# EAGLE design 1sqInchLogicAnalyzer (EAGLE 6.4)
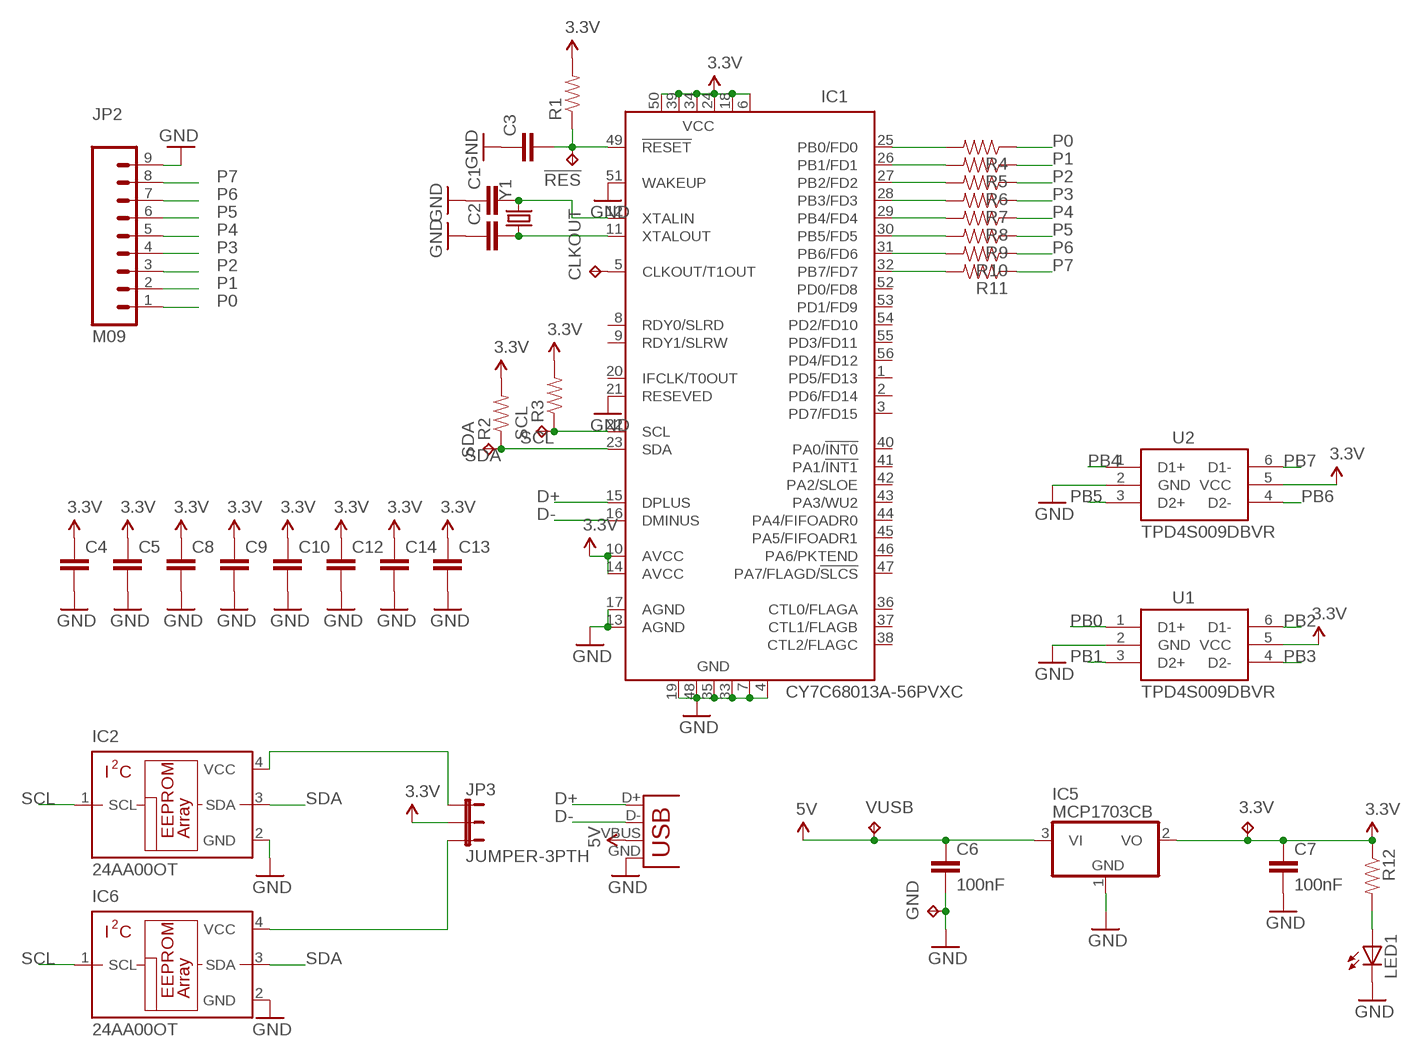
[diagram p0: schematic, sheet 1]

## Parts
3.3V  TPTP07R  [TP07R]
!RES  TPTP07R  [TP07R]
C1  CAP0402-CAP  [0402-CAP]
C2  CAP0402-CAP  [0402-CAP]
C3  CAP0402-CAP  [0402-CAP]
C4  CAP0402-CAP  [0402-CAP]
C5  CAP0402-CAP  [0402-CAP]
C6  100nF  CAP0603-CAP  [0603-CAP]
C7  100nF  CAP0603-CAP  [0603-CAP]
C8  CAP0402-CAP  [0402-CAP]
C9  CAP0402-CAP  [0402-CAP]
C10  CAP0402-CAP  [0402-CAP]
C12  CAP0402-CAP  [0402-CAP]
C13  CAP0402-CAP  [0402-CAP]
C14  CAP0402-CAP  [0402-CAP]
CLKOUT  TPTP07R  [TP07R]
GND  TPTP07R  [TP07R]
IC1  CY7C68013A-56PVXC  [SSOP56]
IC2  24AA00OT  [SOT23-5L]
IC5  MCP1703CB  [SOT23]
IC6  24AA00OT  [SOT23-5L]
JP2  M09  [1X09]
JP3  JUMPER-3PTH  [1X03]
LED1  LED0603  [LED-0603]
R1  RESISTOR0402-RES  [0402-RES]
R2  RESISTOR0402-RES  [0402-RES]
R3  RESISTOR0402-RES  [0402-RES]
R4  RESISTOR0402-RES  [0402-RES]
R5  RESISTOR0402-RES  [0402-RES]
R6  RESISTOR0402-RES  [0402-RES]
R7  RESISTOR0402-RES  [0402-RES]
R8  RESISTOR0402-RES  [0402-RES]
R9  RESISTOR0402-RES  [0402-RES]
R10  RESISTOR0402-RES  [0402-RES]
R11  RESISTOR0402-RES  [0402-RES]
R12  RESISTOR0402-RES  [0402-RES]
SCL  TPTP07R  [TP07R]
SDA  TPTP07R  [TP07R]
U1  TPD4S009DBVR  [TPD4S009DBVR]
U2  TPD4S009DBVR  [TPD4S009DBVR]
VUSB  TPTP07R  [TP07R]
X2  USB-MICROB  [USB-MICROB]
Y1  CRYSTAL5X3  [CRYSTAL-SMD-5X3]

## Nets
3.3V: 3.3V.TP C4.1 C5.1 C7.1 C8.1 C9.1 C10.1 C12.1 C13.1 C14.1 IC1.6(VCC) IC1.10(AVCC) IC1.14(AVCC) IC1.18(VCC) IC1.24(VCC) IC1.34(VCC) IC1.39(VCC) IC1.50(VCC) IC5.2(VO) JP3.2 R1.2 R2.2 R3.2 R12.1 U1.5(VCC) U2.5(VCC)
5V: C6.1 IC5.3(VI) VUSB.TP X2.VBUS
D+: IC1.15(DPLUS) X2.D+
D-: IC1.16(DMINUS) X2.D-
GND: C1.1 C2.1 C3.1 C4.2 C5.2 C6.2 C7.2 C8.2 C9.2 C10.2 C12.2 C13.2 C14.2 GND.TP IC1.4(GND) IC1.7(GND) IC1.13(AGND) IC1.17(AGND) IC1.19(GND) IC1.21(RESEVED) IC1.33(GND) IC1.35(GND) IC1.48(GND) IC1.51(WAKEUP) IC2.2(GND) IC5.1(GND) IC6.2(GND) JP2.9 LED1.C U1.2(GND) U2.2(GND) X2.GND
N$1: IC6.4(VCC) JP3.3
N$2: IC2.4(VCC) JP3.1
N$3: C1.2 IC1.12(XTALIN) Y1.3
N$4: C2.2 IC1.11(XTALOUT) Y1.1
N$5: !RES.TP C3.2 IC1.49(!RESET) R1.1
N$6: LED1.A R12.2
N$7: CLKOUT.TP IC1.5(CLKOUT/T1OUT)
P0: JP2.1 R4.1
P1: JP2.2 R5.1
P2: JP2.3 R6.1
P3: JP2.4 R7.1
P4: JP2.5 R8.1
P5: JP2.6 R9.1
P6: JP2.7 R10.1
P7: JP2.8 R11.1
PB0: IC1.25(PB0/FD0) R4.2 U1.1(D1+)
PB1: IC1.26(PB1/FD1) R5.2 U1.3(D2+)
PB2: IC1.27(PB2/FD2) R6.2 U1.6(D1-)
PB3: IC1.28(PB3/FD3) R7.2 U1.4(D2-)
PB4: IC1.29(PB4/FD4) R8.2 U2.1(D1+)
PB5: IC1.30(PB5/FD5) R9.2 U2.3(D2+)
PB6: IC1.31(PB6/FD6) R10.2 U2.4(D2-)
PB7: IC1.32(PB7/FD7) R11.2 U2.6(D1-)
SCL: IC1.22(SCL) IC2.1(SCL) IC6.1(SCL) R3.1 SCL.TP
SDA: IC1.23(SDA) IC2.3(SDA) IC6.3(SDA) R2.1 SDA.TP
Unconnected: IC1.1(PD5/FD13) IC1.2(PD6/FD14) IC1.3(PD7/FD15) IC1.8(RDY0/SLRD) IC1.9(RDY1/SLRW) IC1.20(IFCLK/T0OUT) IC1.36(CTL0/FLAGA) IC1.37(CTL1/FLAGB) IC1.38(CTL2/FLAGC) IC1.40(PA0/!INT0) IC1.41(PA1/!INT1) IC1.42(PA2/SLOE) IC1.43(PA3/WU2) IC1.44(PA4/FIFOADR0) IC1.45(PA5/FIFOADR1) IC1.46(PA6/PKTEND) IC1.47(PA7/FLAGD/!SLCS) IC1.52(PD0/FD8) IC1.53(PD1/FD9) IC1.54(PD2/FD10) IC1.55(PD3/FD11) IC1.56(PD4/FD12)

## Library data of the parts
3.3V !RES CLKOUT GND SCL SDA VUSB = testpad:TP: Test pad
C1-C10 C12-C14 = SparkFun-Passives:CAP: Capacitor Standard 0603 ceramic capacitor, and 0.1" leaded capacitor.
IC1 = cypress:CY7C6801*A-56: EZ-USB FX2LP (TM) USB Microcontroller Source: http://www.cypress.com .. cy7c68013a_5.pdf; MF: CYPRESS SEMICONDUCTOR CORPORAT; MPN: CY7C68013A-56PVXC; OC_FARNELL: 1269134; OC_NEWARK: 19M7114
IC2 IC6 = microchip:24*00: Serial EEPROM 128 bit, I2C (AA = 1.8 V/LC = 2.5 V/C = 5.0 V); MF: MICROCHIP; MPN: 24AA00T-I/OTG; OC_FARNELL: 1331264; OC_NEWARK: 89H3038
IC5 = linear:MCP1703: 250 mA, 16V, Low Quiescent Current LDO Regulator Source: http://ww1.microchip.com/downloads/en/DeviceDoc/22049b.pdf
JP2 = SparkFun-Connectors:M09: Header 9 Standard 9-pin 0.1" header. Use with straight break away headers (SKU : PRT-00116), right angle break away headers (PRT-00553), swiss pins (PRT-00743), machine pins (PRT-00117), and female headers (PRT-00115).
JP3 = SparkFun-Passives:JUMPER-3
LED1 = SparkFun-LED:LED: LEDs Standard schematic elements and footprints for 5mm, 3mm, 1206, and 0603 sized LEDs. 5mm - Spark Fun Electronics SKU : COM-00529 (and others)
R1-R12 = SparkFun-Passives:RESISTOR: Resistor Basic schematic elements and footprints for 0603, 1206, and PTH resistors.
U1 U2 = esd-clamp:TPD4S009DBVR
X2 = SparkFun-Connectors:USB: USB Connectors USB-B-PTH is fully proven SKU : PRT-00139 USB-miniB is fully proven SKU : PRT-00587 USB-A-PCB is untested. USB-A-H is throughly reviewed, but untested. Spark Fun Electronics SKU : PRT-00437 USB-B-SMT is throughly reviewed, but untested. Needs silkscreen touching up. USB-A-S has not been used/tested USB-MB-H has not been used/tested
Y1 = SparkFun-FreqCtrl:CRYSTAL: Various standard crystals. Proven footprints. Spark Fun Electronics SKU : COM-00534

## Board
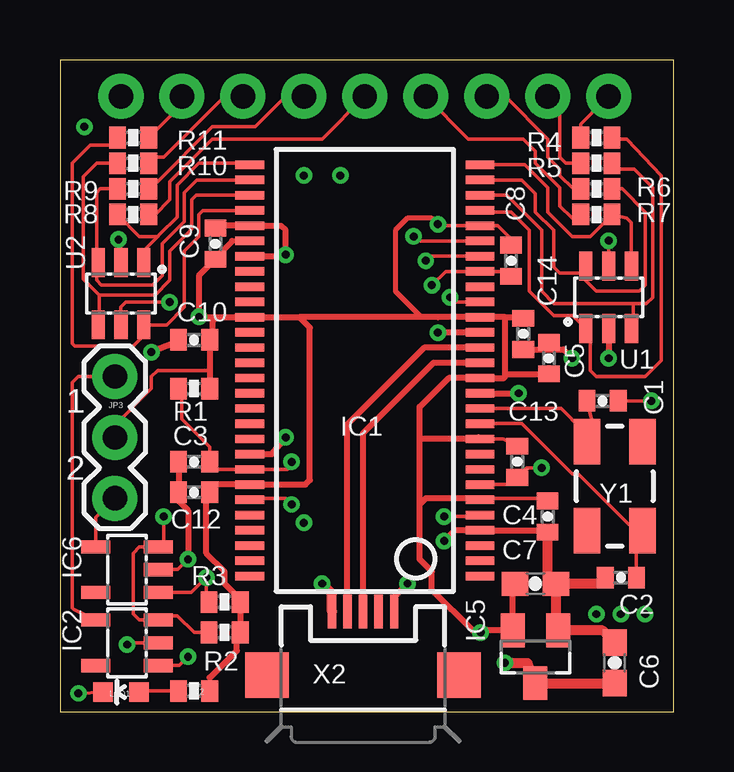
[diagram p1: board, top side]
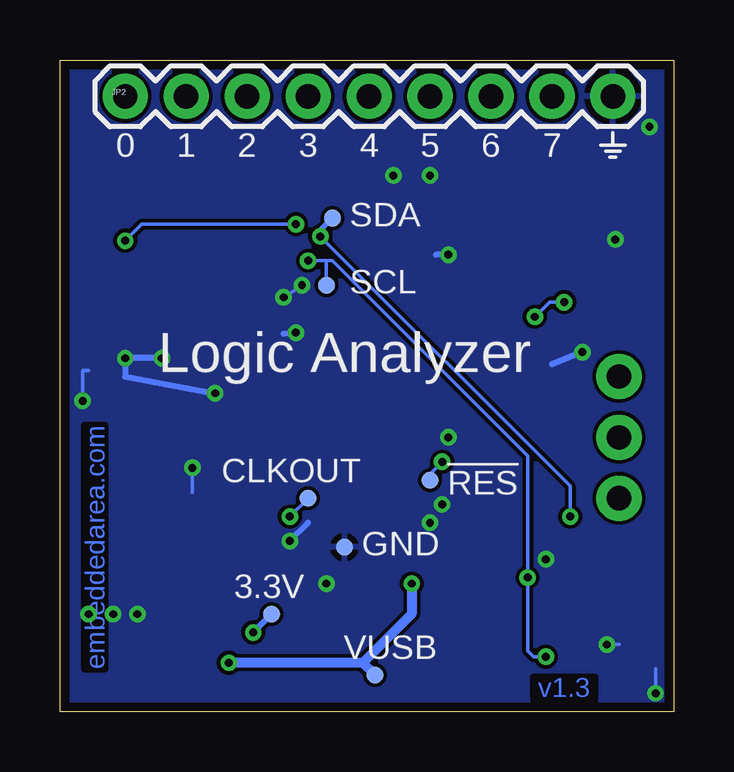
[diagram p2: board, bottom side, seen from below]

Size 25.58 x 27.17 mm. Coordinates in mm from the lower left corner, seen from the top.
Outline: 0,0 25.58,0 25.58,27.17 0,27.17 0,0
Copper layers (1*16): Top 0.0356mm / dielectric 1.5011mm / Bottom 0.0356mm
Design rules "LaenPCBOrder": minimum track width 6mil, minimum drill 13mil, track to track 6mil, track to pad 6mil, pad to pad 6mil, via to via 6mil, smd to smd 6mil, copper to edge 15mil, drill to drill 6mil, minimum pad ring 7mil, minimum via ring 7mil, stop-mask expansion 4mil, vias tented up to drill 13mil, thermal gap 10mil

### Footprints (pad centres in the part's own frame; a part is rotated, then mirrored left to right if it is on the bottom)
TP07R = smd 0.7 x 0.7: TP 0,0
0402-CAP = smd 0.7 x 0.9: 1 -0.65,0; 2 0.65,0
0603-CAP = smd 1.1 x 1: 1 -0.85,0; 2 0.85,0
SSOP56 = smd 0.35 x 1.2: 1 -8.572,-4.8; 2 -7.938,-4.8; 3 -7.303,-4.8; 4 -6.668,-4.8; 5 -6.032,-4.8; 6 -5.397,-4.8; 7 -4.763,-4.8; 8 -4.128,-4.8; 9 -3.493,-4.8; 10 -2.857,-4.8; 11 -2.223,-4.8; 12 -1.587,-4.8; 13 -0.953,-4.8; 14 -0.318,-4.8; 15 0.318,-4.8; 16 0.953,-4.8; 17 1.587,-4.8; 18 2.223,-4.8; 19 2.857,-4.8; 20 3.493,-4.8; 21 4.128,-4.8; 22 4.763,-4.8; 23 5.397,-4.8; 24 6.032,-4.8; 25 6.668,-4.8; 26 7.303,-4.8; 27 7.938,-4.8; 28 8.572,-4.8; 29 8.572,4.8; 30 7.938,4.8; 31 7.303,4.8; 32 6.668,4.8; 33 6.032,4.8; 34 5.397,4.8; 35 4.763,4.8; 36 4.128,4.8; 37 3.493,4.8; 38 2.857,4.8; 39 2.223,4.8; 40 1.587,4.8; 41 0.953,4.8; 42 0.318,4.8; 43 -0.318,4.8; 44 -0.953,4.8; 45 -1.587,4.8; 46 -2.223,4.8; 47 -2.857,4.8; 48 -3.493,4.8; 49 -4.128,4.8; 50 -4.763,4.8; 51 -5.397,4.8; 52 -6.032,4.8; 53 -6.668,4.8; 54 -7.303,4.8; 55 -7.938,4.8; 56 -8.572,4.8
SOT23-5L = smd 0.55 x 1.2: 1 -0.95,-1.3; 2 0,-1.3; 3 0.95,-1.3; 4 0.95,1.3; 5 -0.95,1.3
SOT23 = smd 1 x 1.4: 1 -0.95,-1.1; 2 0.95,-1.1; 3 0,1.1
1X09 = drill 1.016 pad 1.88: 1 0,0; 2 2.54,0; 3 5.08,0; 4 7.62,0; 5 10.16,0; 6 12.7,0; 7 15.24,0; 8 17.78,0; 9 20.32,0
1X03 = drill 1.016 pad 1.88: 1 0,0; 2 2.54,0; 3 5.08,0
LED-0603 = smd 0.8 x 0.8: A 0,-0.75; C 0,0.75
0402-RES = smd 0.7 x 0.9: 1 -0.65,0; 2 0.65,0
TPD4S009DBVR = smd 0.55 x 1.2: 1 -0.95,-1.3; 2 0,-1.3; 3 0.95,-1.3; 4 0.95,1.3; 5 0,1.3; 6 -0.95,1.3
USB-MICROB = smd 0.35 x 1.4: D+ 0,2.65; D- -0.65,2.65; GND 1.3,2.65; ID 0.65,2.65; VBUS -1.3,2.65 | smd 1.8 x 1.9: MT1 -4,0; MT2 4,0
CRYSTAL-SMD-5X3 = smd 1.9 x 1.1: 1 -1.85,-1.15; 2 1.85,-1.15; 3 1.85,1.15; 4 -1.85,1.15

### Placement (x,y rotation side)
3.3V  16.76,4.06 0 bottom
!RES  10.16,9.65 90 bottom
C1  22.61,12.95 180 top
C2  23.37,5.59 0 top
C3  5.59,10.41 0 top
C4  20.32,8.13 270 top
C5  19.3,15.75 270 top
C6  23.11,2.03 90 top
C7  19.81,5.33 0 top
C8  18.8,18.8 270 top
C9  6.48,19.51 90 top
C10  5.59,15.49 180 top
C12  5.59,9.14 180 top
C13  19.05,10.41 270 top
C14  20.37,14.73 90 top
CLKOUT  15.24,8.89 90 bottom
GND  13.72,6.86 0 bottom
IC1  12.7,14.22 90 top
IC2  2.79,2.87 90 top
IC5  19.81,2.29 180 top
IC6  2.79,5.92 90 top
JP2  22.86,25.65 0 bottom
JP3  2.29,13.97 270 top
LED1  2.54,0.81 90 top
R1  5.59,13.46 0 top
R2  6.86,3.3 0 top
R3  6.86,4.57 0 top
R4  22.35,23.93 0 top
R5  22.35,22.86 0 top
R6  22.35,21.79 0 top
R7  22.35,20.73 0 top
R8  3.05,20.73 180 top
R9  3.05,21.79 180 top
R10  3.05,22.86 180 top
R11  3.05,23.93 180 top
R12  5.59,0.86 180 top
SCL  14.48,17.78 270 bottom
SDA  14.22,20.57 90 bottom
U1  22.86,17.27 0 top
U2  2.54,17.42 180 top
VUSB  12.45,1.52 0 bottom
X2  12.63,1.52 0 top
Y1  23.11,9.4 90 top

### Tracks (layer width: path | path; a pad name or v marks a point on that pad's centre or on a via)
3.3V  (via drill 0.33)
  Top 0.152: IC1.10 18.46,11.37 C13.1 | R1.2 6.35,13.35 | IC1.39 7.32,16.45 | 7.32,16.45 6.54,16.45 | 6.35,15.61 C10.1 | R12.1 6.24,1.41 | 7.37,3.16 R2.2 | U2.5 2.54,16.87 2.74,17.07 v4.57,17.07 | 7.3,16.46 7.32,16.45 | IC1.24 18.24,20.26 18.8,19.7 C8.1 | 17.44,20.32 IC1.24 | IC1.6 17.56,8.89 20.32,8.89 20.46,9 C4.1 | U1.5 v22.86,19.63 | v15.75,20.32 15.81,20.26 IC1.24 | JP3.2 2.29,11.94 3.81,13.46 3.81,13.97 4.06,14.22 6.24,14.22
  Top 0.203: 7.43,19.62 7.18,19.62 | 6.48,18.92 C9.1 | v15.75,20.32 15.49,20.57 14.48,20.57 13.97,20.07 13.97,17.53 15.05,16.45 15.75,16.45
  Top 0.254: 18.54,14.08 18.54,16.45 | 17.44,11.43 IC1.10 15.05,11.37 14.99,11.43 | C10.1 6.24,14.22 R1.2 | 6.54,16.45 6.35,16.26 6.35,15.61 | 6.24,1.41 7.37,2.54 7.37,3.16 | R2.2 R3.2 7.51,4.68 6.86,5.33 6.86,5.84 6.1,6.6 6.1,9 C12.1 6.56,9.46 IC1.50 10.22,9.46 10.41,9.65 10.41,16 9.97,16.45 | 7.3,16.46 v5.79,16.46 5.79,18.17 C9.1 6.29,19.05 | IC1.39 9.97,16.45 | 9.97,16.45 15.75,16.45 IC1.18 18.54,16.45 | 18.54,16.45 19.26,16.45 C5.1 | 18.54,14.08 18.54,13.97 18.48,13.91 IC1.14 16.19,13.91 14.99,12.7 14.99,11.43 | 18.54,14.08 C14.1 | IC1.34 7.43,19.62 | 7.18,19.62 6.48,18.92 | 19.05,5.33 C7.1 18.86,5.23 IC5.2 17.19,3.39 | 17.19,3.39 15.49,5.08 15.49,5.84 14.99,6.35 14.99,8.64 | 14.99,8.64 14.99,11.43 | 17.56,8.89 15.24,8.89 14.99,8.64 | 17.19,3.39 17.27,3.3 v17.53,3.3
  Bottom 0.152: v4.57,17.07 5.18,17.07 v5.79,16.46 | v15.75,20.32 22.17,20.32 v22.86,19.63
  Bottom 0.254: 3.3V.TP v17.53,3.3
5V  (via drill 0.33)
  Top 0.406: v18.54,2.03 19.47,2.03 IC5.3 19.9,1.19 19.9,1.18 C6.1 | X2.VBUS 11.33,4.93 v10.92,5.33
  Bottom 0.406: v10.92,5.33 10.92,4.06 12.95,2.03 | 12.95,2.03 v18.54,2.03 | VUSB.TP 12.95,2.03
D+
  Top 0.254: IC1.15 15.56,14.54 12.83,11.81 12.7,11.68 12.63,11.61 X2.D+
D-
  Top 0.254: IC1.16 15.18,15.18 11.98,11.98 X2.D-
GND  (via drill 0.33)
  Top 0.152: 7.96,20.32 IC1.33 | U2.2 2.54,19.38 v2.44,19.68 | LED1.C v0.76,0.76 | IC1.7 18.75,9.46 C13.2 19.45,10.16 v20.07,10.16 | C8.2 18.59,18.35 IC1.21 16.07,18.35 v15.49,17.78 | IC1.51 7.96,8.89 9.4,8.89 v9.65,8.64 | IC1.19 16.45,17.08 v16.26,17.27 | C1.1 v24.64,12.95 | IC2.2 2.87,2.87 v2.79,2.79 | IC6.2 4.9,5.92 v5.33,6.35
  Top 0.254: C7.2 20.92,5.17 | IC1.48 8.83,10.73 v9.4,11.43 | IC1.13 v19.11,13.27 | v16,7.11 16.45,7.56 IC1.4 20.32,7.56 C4.2 | IC1.17 16.57,15.81 v15.75,15.8 | C5.2 20.54,15.1 | 20.54,15.1 C14.2 | U1.2 v22.86,14.73 | 20.54,15.1 20.97,15.1 v21.34,14.73 | X2.GND 13.93,4.78 v14.48,5.33 | C3.1 C12.2 4.94,8.78 5.33,8.38 v5.33,6.35 | C10.2 4.83,15.38 v3.81,14.99 | C9.2 6.7,20.26 IC1.33 9.21,20.26 9.4,20.07 v9.4,19.05 9.34,18.99 IC1.35
  Top 0.406: C7.2 20.66,3.49 IC5.1 22.61,3.39 C6.2 | C2.1 22.46,5.33 C7.2 | C7.2 20.32,5.68 C4.2
  Bottom 0.152: v0.76,0.76 0.76,1.78 | 20.07,9.14 v20.07,10.16 20.07,10.41 | v9.65,8.64 9.91,8.64 | v16.26,17.27 v15.49,17.78 | v2.79,2.79 2.29,2.79 | v24.64,12.95 24.64,14.22 24.38,14.22
  Bottom 0.254: v16,7.11 15.24,7.87 | v15.75,15.8 16.26,15.75 | v19.11,13.27 22.86,13.97 v22.86,14.73 v21.34,14.73 | v9.4,19.05 9.91,19.05 | v3.81,14.99 5.08,14.48
  other vias: 1.02,24.38 10.16,7.87 10.16,22.35 11.68,22.35 22.35,4.06 23.37,4.06 24.38,4.06
  pour Bottom: 0,0 0,27.18 25.65,27.18 25.65,0
N$1
  Top 0.152: IC6.4 1.49,8.1 JP3.3
N$2
  Top 0.152: IC2.4 0.57,4.25 0.51,4.32 0.51,13.72 0.76,13.97 JP3.1
N$3
  Top 0.152: IC1.12 20.89,12.64 21.08,12.45 21.56,11.93 | 21.56,11.93 Y1.3 | C1.2 22.21,11.93 21.56,11.93
N$4
  Top 0.152: 17.56,11.94 IC1.11 19.24,12 21.34,9.91 21.59,9.91 23.69,7.8 23.8,7.8 Y1.1 | 24.26,7.99 Y1.1 | Y1.1 24.02,7.56 C2.2
N$5  (via drill 0.33)
  Top 0.152: v9.65,10.41 9.46,10.1 IC1.49 6.56,10.1 C3.2 6.24,11.03 5.08,12.19 5.08,13.32 R1.1
  Bottom 0.152: !RES.TP 10.16,9.91 v9.65,10.41
N$6
  Top 0.152: R12.2 3.34,0.86 LED1.A
N$7  (via drill 0.33)
  Top 0.152: IC1.5 17.44,8.13 v16,8.13
  Bottom 0.152: v16,8.13 CLKOUT.TP
P0
  Top 0.152: R4.1 21.7,24.5 JP2.1
P1
  Top 0.152: R5.1 21.08,22.86 20.83,23.11 20.83,25.15 JP2.2
P2
  Top 0.152: R6.1 21.39,21.79 20.83,22.35 20.83,22.61 20.32,23.11 20.32,23.88 18.54,25.65 JP2.3
P3
  Top 0.152: R7.1 21.34,20.57 20.83,21.08 20.83,21.84 19.81,22.86 19.81,23.37 19.3,23.88 17.02,23.88 JP2.4
P4
  Top 0.152: R8.1 3.96,20.73 4.57,21.34 4.57,22.1 6.35,23.88 10.92,23.88 JP2.5
P5
  Top 0.152: R9.1 4,22.1 4.06,22.1 6.35,24.38 8.13,24.38 9.4,25.65 JP2.6
P6
  Top 0.152: R10.1 3.95,23.11 4.32,23.11 6.86,25.65 JP2.7
P7
  Top 0.152: R11.1 5.08,25.31 JP2.8
PB0
  Top 0.152: 21.84,15.91 U1.1 | U1.1 21.37,16.51 20.57,16.51 19.56,17.53 19.56,20.07 18.8,20.83 17.56,20.83 IC1.25 | R4.2 23.05,23.88 23.62,23.88 25.04,22.35 25.04,14.63 24.38,13.97 22.35,13.97 22.1,14.22 22.1,15.78 U1.1
PB1
  Top 0.152: 23.88,17.02 20.57,17.02 20.07,17.53 20.07,20.07 18.61,21.53 IC1.26 | 23.88,17.02 24.43,17.02 24.69,17.27 24.69,21.84 23.93,22.61 23.26,22.61 R5.2 | U1.3 23.88,16.04 23.88,17.02
PB2
  Top 0.152: IC1.27 19.24,22.16 19.81,21.59 19.81,20.83 20.57,20.07 20.57,18.54 20.83,18.29 21.63,18.29 U1.6 21.91,17.97 22.35,17.53 24.13,17.53 24.38,17.78 24.38,20.83 23.42,21.79 R6.2
PB3
  Top 0.152: IC1.28 19.37,22.8 20.32,21.84 20.32,20.83 21.34,19.81 22.1,19.81 23,20.72 R7.2 23.62,20.57 23.81,20.39 U1.4
PB4
  Top 0.152: IC1.29 7.84,22.86 5.79,22.86 4.88,21.95 4.88,20.62 4.17,19.91 4.06,19.81 | 4.06,19.81 3.59,19.33 U2.1 | R8.2 3.31,19.81 4.06,19.81
PB5
  Top 0.152: IC1.30 5.7,22.16 5.18,21.64 5.18,20.42 4.27,19.51 4.27,18.19 3.86,17.78 1.73,17.78 1.52,17.98 1.52,18.54 U2.3 1.52,18.79 1.52,21.64 1.68,21.79 R9.2
PB6
  Top 0.152: R10.2 1.52,22.86 0.96,22.3 0.96,18.03 1.63,17.37 | IC1.31 5.68,21.53 5.49,21.34 5.49,20.12 4.57,19.2 4.57,17.98 3.96,17.37 1.63,17.37 | U2.4 1.63,16.16 1.63,17.37
PB7
  Top 0.152: IC1.32 5.96,20.89 5.79,20.73 5.79,19.81 5.18,19.2 5.18,16.87 4.44,16.12 U2.6 3.49,15.68 3.05,15.24 0.61,15.24 0.51,15.34 0.51,22.86 1.27,23.62 2.09,23.62 R11.2
SCL  (via drill 0.33)
  Top 0.152: IC1.22 15.43,18.99 v15.24,18.8 | 5.91,5.4 v6.1,5.59 | R3.1 6.1,4.68 v6.1,5.59 | IC6.1 5.48,4.97 v6.1,5.59 | IC2.1 4.97,1.92 v5.33,2.29
  Bottom 0.152: v6.1,5.59 6.1,10.67 14.22,18.8 14.48,18.8 | 5.91,5.4 v6.1,5.59 | v5.33,2.29 5.84,2.29 6.1,2.54 v6.1,5.59 | SCL.TP 14.48,18.8 | 14.48,18.8 v15.24,18.8
SDA  (via drill 0.33)
  Top 0.152: 5.84,3.3 R2.1 5.59,3.3 4.89,4 4.64,4 IC2.3 3.29,3.82 3.05,4.06 3.05,6.6 3.3,6.86 4.08,6.86 IC6.3 4.32,7.09 v4.32,8.13 | IC1.23 15.05,19.62 v14.73,19.81
  Bottom 0.152: v4.32,8.13 4.32,9.4 v14.73,19.81 14.48,19.56
  Bottom 0.203: SDA.TP 14.73,20.07 v14.73,19.81

### Text on the board
Bottom: embeddedarea.com | v1.3
tNames: 1 | 2
bNames: 7 | 6 | 5 | 4 | 3 | 2 | 1 | 0 | Logic Analyzer